# EAGLE design driver (EAGLE 7.7.0)
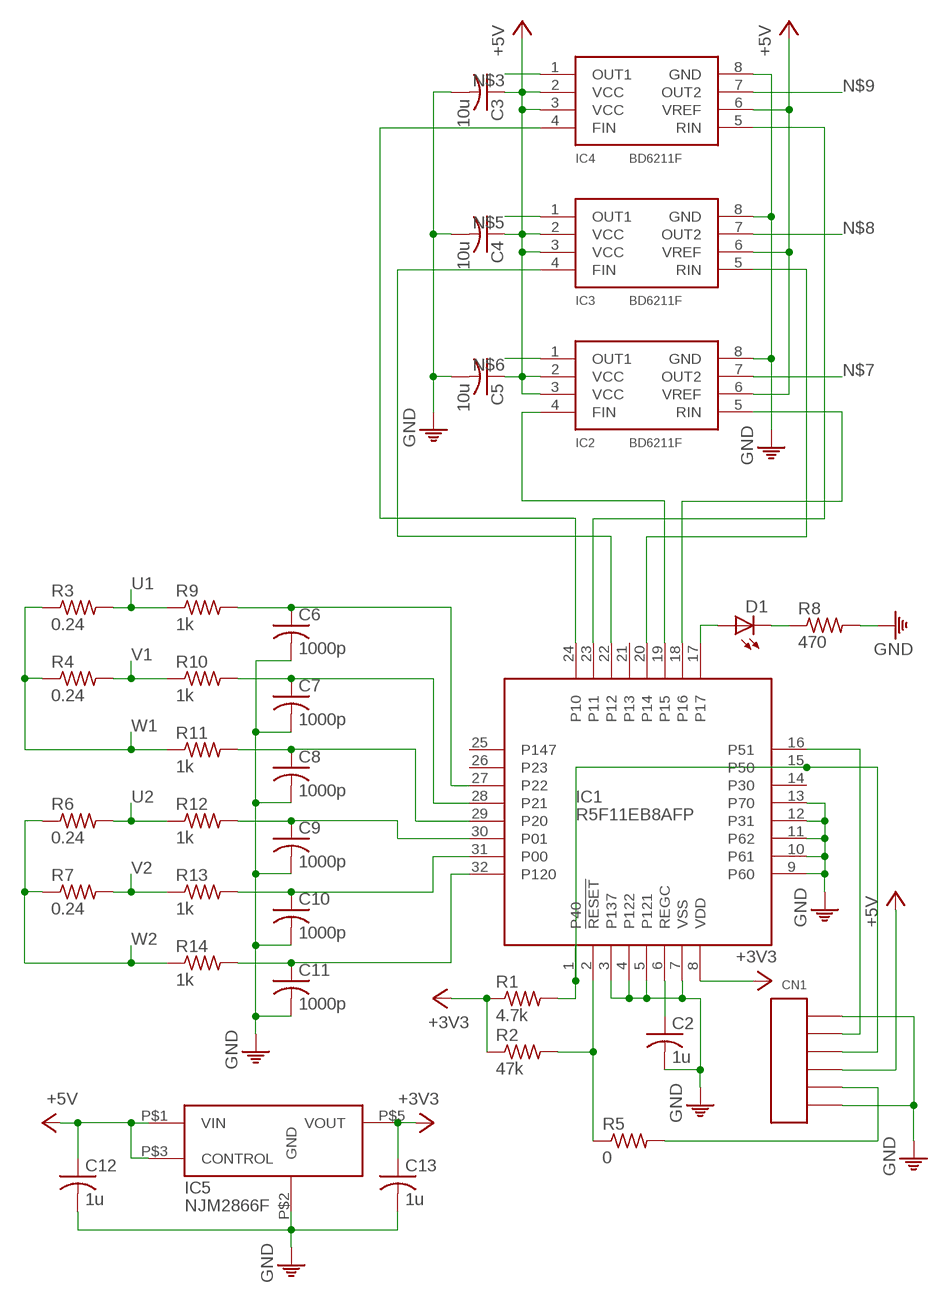
[diagram p0: schematic, sheet 1]

## Parts
C2  1u  C2012  [C2012]
C3  10u  C2012  [C2012]
C4  10u  C2012  [C2012]
C5  10u  C2012  [C2012]
C6  1000p  C2012  [C2012]
C7  1000p  C2012  [C2012]
C8  1000p  C2012  [C2012]
C9  1000p  C2012  [C2012]
C10  1000p  C2012  [C2012]
C11  1000p  C2012  [C2012]
C12  1u  C2012  [C2012]
C13  1u  C2012  [C2012]
CN1  PH-1X06RG  [PH-1X06RG]
D1  LED2012  [CHIP-LED0805]
IC1  R5F11EB8AFP  [P-LQFP32-7X7-0.80]
IC2  BD6211F  [SOP8]
IC3  BD6211F  [SOP8]
IC4  BD6211F  [SOP8]
IC5  NJM2866F  [SOT-23-5]
R1  4.7k  R2012  [R2012]
R2  47k  R2012  [R2012]
R3  0.24  R3225  [R3225]
R4  0.24  R3225  [R3225]
R5  0  R2012  [R2012]
R6  0.24  R3225  [R3225]
R7  0.24  R3225  [R3225]
R8  470  R2012  [R2012]
R9  1k  R2012  [R2012]
R10  1k  R2012  [R2012]
R11  1k  R2012  [R2012]
R12  1k  R2012  [R2012]
R13  1k  R2012  [R2012]
R14  1k  R2012  [R2012]

## Nets
+3V3: C13.1 IC1.8(VDD) IC5.P$5(VOUT) R1.1 R2.1
+5V: C3.1 C4.1 C5.1 C12.1 CN1.P$3 IC2.2(VCC) IC2.3(VCC) IC2.6(VREF) IC3.2(VCC) IC3.3(VCC) IC3.6(VREF) IC4.2(VCC) IC4.3(VCC) IC4.6(VREF) IC5.P$1(VIN) IC5.P$3(CONTROL)
GND: C2.2 C3.2 C4.2 C5.2 C6.2 C7.2 C8.2 C9.2 C10.2 C11.2 C12.2 C13.2 CN1.P$1 CN1.P$6 IC1.3(P137) IC1.4(P122) IC1.5(P121) IC1.7(VSS) IC1.9(P60) IC1.10(P61) IC1.11(P62) IC1.12(P31) IC1.13(P70) IC2.8(GND) IC3.8(GND) IC4.8(GND) IC5.P$2(GND) R8.2
N$1: C2.1 IC1.6(REGC)
N$2: IC1.2(!RESET!) R2.2 R5.1
N$3: IC4.1(OUT1)
N$4: CN1.P$4 IC1.1(P40) IC1.15(P50) R1.2
N$5: IC3.1(OUT1)
N$6: IC2.1(OUT1)
N$7: IC2.7(OUT2)
N$8: IC3.7(OUT2)
N$9: IC4.7(OUT2)
N$10: IC1.19(P15) IC2.4(FIN)
N$11: IC1.18(P16) IC2.5(RIN)
N$12: IC1.23(P11) IC4.5(RIN)
N$13: IC1.24(P10) IC4.4(FIN)
N$14: C6.1 IC1.27(P22) R9.2
N$15: C7.1 IC1.28(P21) R10.2
N$16: C8.1 IC1.29(P20) R11.2
N$17: C9.1 IC1.30(P01) R12.2
N$18: C10.1 IC1.31(P00) R13.2
N$19: C11.1 IC1.32(P120) R14.2
N$20: CN1.P$5 IC1.16(P51)
N$21: CN1.P$2 R5.2
N$22: D1.A IC1.17
N$23: IC1.22(P12) IC3.4(FIN)
N$24: IC1.20(P14) IC3.5(RIN)
N$25: D1.C R8.1
U1: R3.2 R9.1
U2: R6.2 R12.1
V1: R4.2 R10.1
V2: R7.2 R13.1
W1: R3.1 R4.1 R11.1
W2: R6.1 R7.1 R14.1
Unconnected: IC1.14(P30) IC1.21(P13) IC1.25(P147) IC1.26(P23)

## Library data of the parts
C2-C13 = MyLib:C: CAPACITOR, American symbol
CN1 = MyLib:PH-1X06
D1 = MyLib:LED
IC1 = MyLib:R5F11EB*FP
IC2-IC4 = MyLib:BD6211F
IC5 = MyLib:NJM2866F
R1-R14 = MyLib:R: RESISTOR, American symbol

## Board
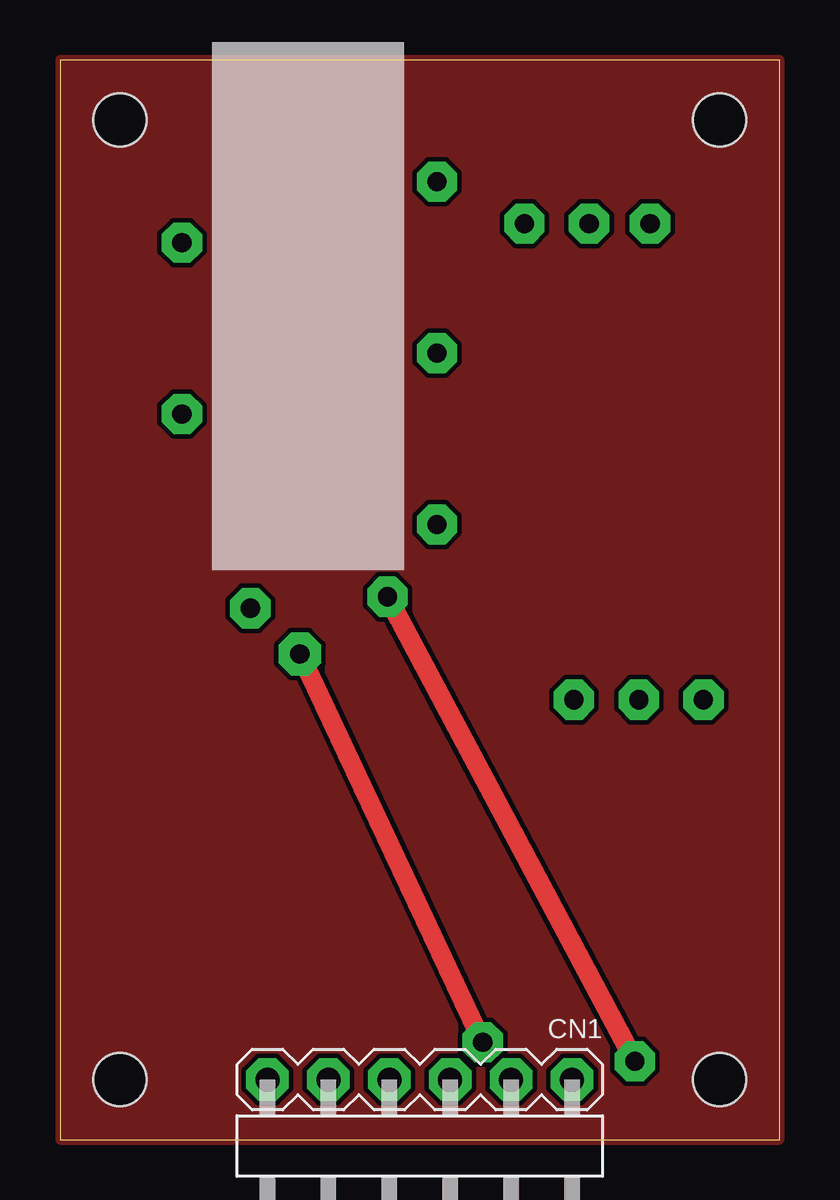
[diagram p1: board, top side]
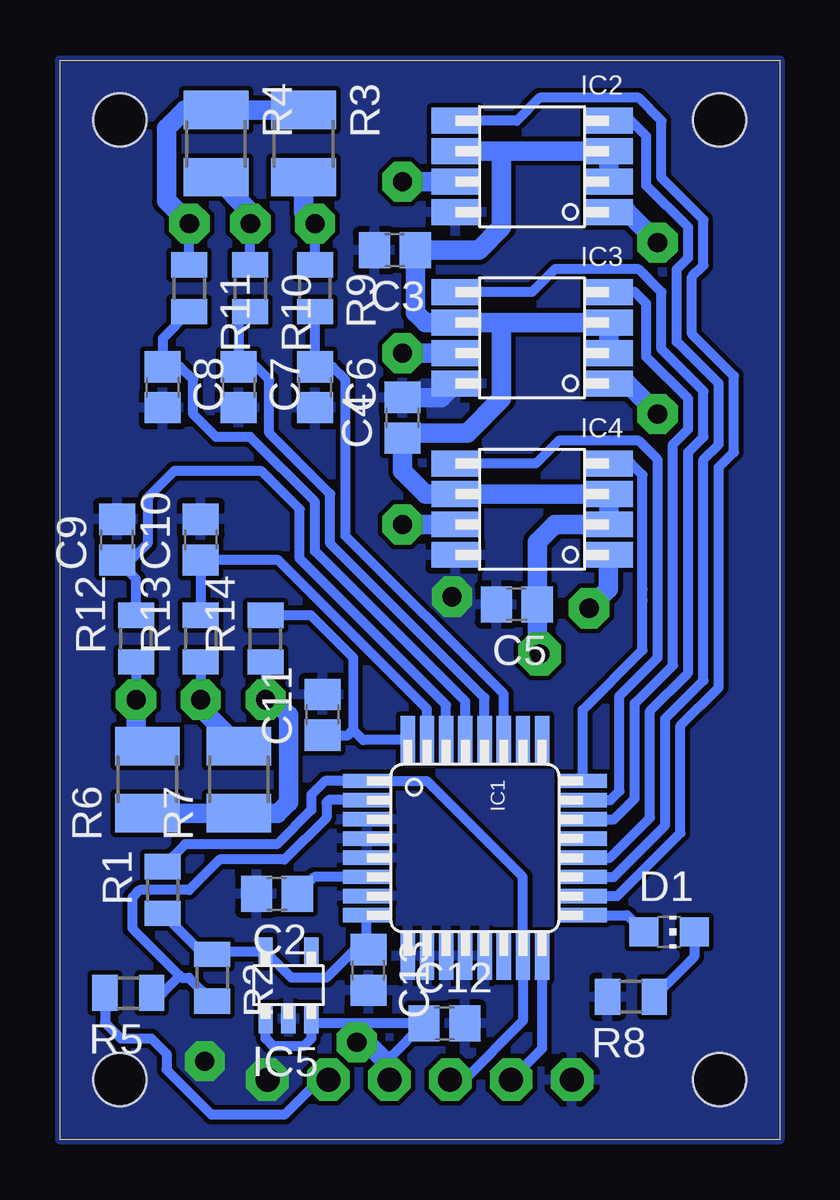
[diagram p2: board, bottom side, seen from below]

Size 30 x 45 mm. Coordinates in mm from the lower left corner, seen from the top.
Outline: 0,0 30,0 30,45 0,45 0,0
Copper layers (1*16): Top 0.0356mm / dielectric 1.5011mm / Bottom 0.0356mm
Design rules "formitaminimum": minimum track width 5mil, minimum drill 0.5994mm, track to track 0.2007mm, track to pad 0.2007mm, pad to pad 0.2007mm, via to via 0.2007mm, smd to smd 0mil, copper to edge 0mil, drill to drill 1mil, minimum pad ring 10mil, minimum via ring 8mil, stop-mask expansion 4mil, vias tented up to drill 0mil, thermal gap 10mil
Holes 2.2 mm at 2.5,42.5 27.5,42.5 2.5,2.5 27.5,2.5

### Footprints (pad centres in the part's own frame; a part is rotated, then mirrored left to right if it is on the bottom)
C2012 = smd 1.3 x 1.5: 1 -0.85,0; 2 0.85,0
PH-1X06RG = drill 1 pad 1.778 octagon: P$1 -6.35,0; P$2 -3.81,0; P$3 -1.27,0; P$4 1.27,0; P$5 3.81,0; P$6 6.35,0
CHIP-LED0805 = smd 1.2 x 1.2: A 0,-1.05; C 0,1.05
P-LQFP32-7X7-0.80 = smd 0.6 x 2: 1 -2.8,-4.5; 2 -2,-4.5; 3 -1.2,-4.5; 4 -0.4,-4.5; 5 0.4,-4.5; 6 1.2,-4.5; 7 2,-4.5; 8 2.8,-4.5; 17 2.8,4.5; 18 2,4.5; 19 1.2,4.5; 20 0.4,4.5; 21 -0.4,4.5; 22 -1.2,4.5; 23 -2,4.5; 24 -2.8,4.5 | smd 2 x 0.6: 9 4.5,-2.8; 10 4.5,-2; 11 4.5,-1.2; 12 4.5,-0.4; 13 4.5,0.4; 14 4.5,1.2; 15 4.5,2; 16 4.5,2.8; 25 -4.5,2.8; 26 -4.5,2; 27 -4.5,1.2; 28 -4.5,0.4; 29 -4.5,-0.4; 30 -4.5,-1.2; 31 -4.5,-2; 32 -4.5,-2.8
SOP8 = smd 2 x 1.07: 1 -3.2,1.905; 2 -3.2,0.635; 3 -3.2,-0.635; 4 -3.2,-1.905; 5 3.2,-1.905; 6 3.2,-0.635; 7 3.2,0.635; 8 3.2,1.905
SOT-23-5 = smd 1.2 x 0.6: P$1 -1.4,0.95; P$2 -1.4,0; P$3 -1.4,-0.95; P$4 1.4,-0.95; P$5 1.4,0.95
R2012 = smd 1.046 x 1.5: 1 -0.977,0; 2 0.977,0
R3225 = smd 1.6 x 2.7: 1 -1.4,0; 2 1.4,0

### Placement (x,y rotation side)
C2  20.95,10.24 180 bottom
C3  16.03,37.07 180 bottom
C4  15.72,30.09 90 bottom
C5  10.95,22.31 180 bottom
C6  19.37,31.35 270 bottom
C7  22.54,31.35 270 bottom
C8  25.72,31.35 270 bottom
C9  27.62,25.01 90 bottom
C10  24.13,25.01 90 bottom
C11  19.05,17.7 90 bottom
C12  13.97,4.84 0 bottom
C13  17.14,7.07 270 bottom
CN1  15,2.5 180 top
D1  4.6,8.65 270 bottom
IC1  12.7,12.15 270 bottom
IC2  10.32,40.56 180 bottom
IC3  10.32,33.42 180 bottom
IC4  10.32,26.27 180 bottom
IC5  20.48,6.43 90 bottom
R1  25.72,10.4 90 bottom
R2  23.65,6.75 270 bottom
R3  19.84,41.52 270 bottom
R4  23.5,41.52 270 bottom
R5  27.15,6.11 180 bottom
R6  26.35,15 90 bottom
R7  22.54,15 90 bottom
R8  6.19,5.95 180 bottom
R9  19.37,35.48 270 bottom
R10  22.07,35.48 270 bottom
R11  24.61,35.48 270 bottom
R12  26.83,20.88 90 bottom
R13  24.13,20.88 90 bottom
R14  21.43,20.88 90 bottom

### Tracks (layer width: path | path; a pad name or v marks a point on that pad's centre or on a via)
+3V3
  Bottom 0.406: R1.1 24.02,7.73 R2.1 23.55,7.83 IC5.P$5 20.35,6.75 18.89,6.75 17.72,7.92 C13.1 17.25,8.02 17.25,9.3 IC1.8
+5V  (via drill 0.8 pad 1.68, 0.8 pad 1.78)
  Top 0.813: v10,20.24 v17.62,4.05
  Bottom 0.406: IC5.P$1 21.43,4.21 21.11,3.89 19.84,3.89 19.53,4.21 IC5.P$3 19.34,4.84 C12.1 16.27,3.39 16.27,3.1 CN1.P$3
  Bottom 0.813: IC3.2 IC3.3 11.59,34.05 | 11.59,34.05 IC3.6 14.76,34.05 15.18,34.47 C3.1 12.54,37.07 11.59,38.02 11.59,41.2 | 11.59,34.05 11.59,30.88 13.02,29.45 15.5,29.45 C4.1 15.72,27.86 14.76,26.91 IC4.6 IC4.3 IC4.2 9.37,25.64 10.1,24.9 C5.1 10.1,20.34 v10,20.24 | 11.59,41.2 IC2.6 | IC2.2 IC2.3 11.59,41.2 | v17.62,4.05 17.22,4.05 16.27,3.1
GND  (via drill 0.8 pad 1.68)
  Top 0.813: v23.97,3.26 v13.65,22.62
  Bottom 0.813: C4.2 14.1,30.94 IC3.8
  pour Bottom: 0,0 30,0 30,45 0,45
  pour Bottom (no thermals): 19.68,0.4 23.18,0.4 23.18,4.21 19.68,4.21
N$1
  Bottom 0.406: IC1.6 19.4,10.95 C2.1
N$2
  Bottom 0.406: IC1.2 18.8,14.15 18.89,14.05 18.89,13.42 20.64,11.67 23.34,11.67 24.61,10.4 26.67,10.4 26.99,10.08 26.99,8.81 25,6.83 | 25,6.83 24.92,6.75 24.63,6.75 R2.2 | R5.1 25.72,6.11 25,6.83
N$3  (via drill 0.8 pad 1.68)
  Bottom 0.813: IC4.1 7.14,24.34 7.14,22.94 v7.94,22.15
N$4
  Bottom 0.406: R1.2 24.79,12.3 20.95,12.3 19.53,13.73 19.53,14.37 18.95,14.95 IC1.1 14.71,14.95 10.7,10.94 IC1.15 10.7,4.94 13.14,2.5 CN1.P$4
N$5  (via drill 0.8 pad 1.68)
  Bottom 0.813: 7.14,31.49 IC3.1 6.35,31.51 v5.08,30.24
N$6  (via drill 0.8 pad 1.68)
  Bottom 0.813: IC2.1 6.35,38.66 v5.08,37.39
N$7  (via drill 0.8 pad 1.68)
  Bottom 0.813: v15.72,39.93 IC2.7
N$8  (via drill 0.8 pad 1.68)
  Bottom 0.813: v15.72,32.78 IC3.7
N$9  (via drill 0.8 pad 1.68)
  Bottom 0.813: v15.72,25.64 IC4.7
N$10
  Bottom 0.406: IC2.4 6.19,42.47 5.56,41.83 5.56,39.77 3.81,38.02 3.81,36.75 4.29,36.28 4.29,33.26 2.54,31.51 2.54,28.97 3.17,28.34 3.17,19.13 4.76,17.54 4.76,13.1 6.92,10.95 IC1.19
N$11
  Bottom 0.406: IC2.5 10.95,42.47 10,43.42 5.87,43.42 4.92,42.47 4.92,40.09 3.17,38.34 3.17,36.44 3.65,35.96 3.65,33.58 1.91,31.83 1.91,28.66 2.54,28.02 2.54,18.84 4.13,17.26 4.13,12.78 6.76,10.15 IC1.18
N$12
  Bottom 0.406: IC4.5 10.16,28.18 9.21,29.13 5.87,29.13 5.08,28.34 5.08,20.08 6.67,18.5 6.67,14.53 7.05,14.15 IC1.23
N$13
  Bottom 0.406: IC4.4 6.19,28.18 5.71,27.7 5.71,22.94 5.71,22.46 5.71,20.4 8.2,17.92 IC1.24
N$14
  Bottom 0.406: R9.2 C6.1 18.63,32.2 18.1,31.67 18.1,25.16 11.5,18.57 IC1.27
N$15
  Bottom 0.406: R10.2 22.54,34.03 C7.1 21.8,32.2 21.27,31.67 21.27,29.45 18.73,26.91 18.73,24.85 12.3,18.41 IC1.28
N$16
  Bottom 0.406: R11.2 25.72,33.39 C8.1 24.98,32.2 24.45,31.67 24.45,30.24 23.5,29.29 22.07,29.29 19.37,26.59 19.37,24.53 13.1,18.26 IC1.29
N$17
  Bottom 0.406: R12.2 26.83,23.36 C9.1 27.04,24.16 26.35,24.85 26.35,26.75 25.24,27.86 21.59,27.86 20,26.27 20,24.21 13.9,18.11 IC1.30
N$18
  Bottom 0.406: R13.2 C10.1 20.9,24.16 14.7,17.96 IC1.31
N$19
  Bottom 0.406: R14.2 19.55,21.85 17.78,20.08 17.78,17.07 | 17.78,17.07 18,16.85 C11.1 | IC1.32 17.36,16.65 17.78,17.07
N$20
  Bottom 0.406: IC1.16 9.9,3.79 CN1.P$5
N$21
  Bottom 0.406: CN1.P$2 19.17,2.5 20.64,1.03 23.68,1.03 25.56,2.91 25.56,3.57 26.19,4.21 27.46,4.21 28.12,4.87 R5.2
N$22
  Bottom 0.406: IC1.17 6.35,9.35 D1.A
N$23
  Bottom 0.406: IC3.4 6.03,35.32 5.56,34.85 5.56,32.62 3.81,30.88 3.81,29.61 4.45,28.97 4.45,19.77 6.03,18.18 6.03,14.21 6.9,13.35 IC1.22
N$24
  Bottom 0.406: IC3.5 10.32,35.32 9.37,36.28 5.87,36.28 4.92,35.32 4.92,32.94 3.17,31.2 3.17,29.29 3.81,28.66 3.81,19.45 5.4,17.86 5.4,13.42 7.07,11.75 IC1.20
N$25
  Bottom 0.406: D1.C 3.55,7.62 R8.1
N$26
  pour Top: 0,0 30,0 30,45 0,45
U1  (via drill 0.8 pad 1.68)
  Bottom 0.406: R9.1 v19.37,38.18
  Bottom 0.813: R3.2 19.84,38.66 v19.37,38.18
U2  (via drill 0.8 pad 1.68)
  Bottom 0.406: R12.1 v26.83,18.34
  Bottom 0.813: v26.83,18.34 26.83,16.88 R6.2
V1  (via drill 0.8 pad 1.68)
  Bottom 0.406: R10.1 v22.07,38.18
  Bottom 0.813: v22.07,38.18 22.07,38.69 R4.2
V2  (via drill 0.8 pad 1.68)
  Bottom 0.406: R13.1 v24.13,18.34
  Bottom 0.813: v24.13,18.34 24.13,17.99 R7.2
W1  (via drill 0.8 pad 1.68)
  Bottom 0.406: R11.1 v24.61,38.18
  Bottom 0.813: R3.1 R4.1 24.79,42.91 25.56,42.15 25.56,39.13 v24.61,38.18
W2  (via drill 0.8 pad 1.68)
  Bottom 0.406: R14.1 v21.43,18.34
  Bottom 0.813: R6.1 R7.1 20.93,13.6 20.48,14.05 20.48,17.7 21.11,18.34 v21.43,18.34